# EAGLE schematic motor_schematic (EAGLE 8.4.1)
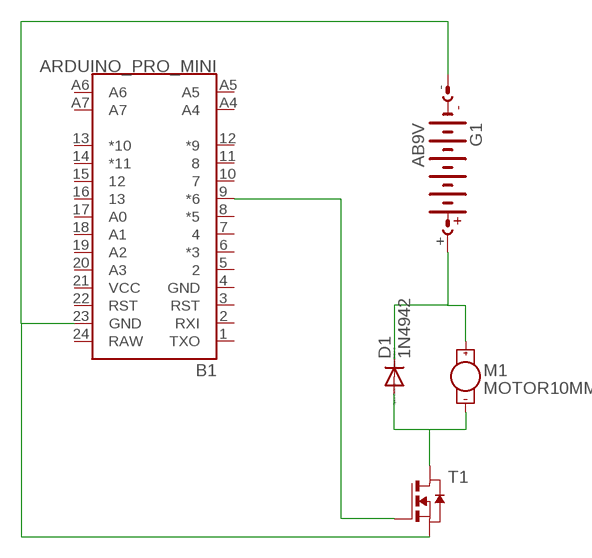
[diagram p0: schematic, sheet 1]

## Parts
B1  ARDUINO_PRO_MINI  [ARDUINO_PRO_MINI]
D1  1N4942  [DO41-10]
G1  AB9V  [AB9V]
M1  MOTOR10MM  [VIBE-MOTOR-10MM]
T1  NMOSSOT23  [SOT-23]

## Nets
N$1: D1.C G1.+ M1.+
N$2: D1.A M1.- T1.1(D)
N$3: B1.9(*6) T1.3(G)
N$4: B1.23(GND) G1.- T1.2(S)
Unconnected: B1.1(TXO) B1.2(RXI) B1.3(RST) B1.5 B1.6(*3) B1.7 B1.8(*5) B1.10 B1.11 B1.12(*9) B1.13(*10) B1.14(*11) B1.15 B1.16 B1.17(A0) B1.18(A1) B1.19(A2) B1.20(A3) B1.22(RST) B1.A4 B1.A5 B1.A6 B1.A7

## Power pins joined to a net without a drawn wire
GND: B1.4(GND)
RAW: B1.24(RAW)
VCC: B1.21(VCC)

## Library data of the parts
B1 = SparkFun-Boards:ARDUINO_PRO_MINI: SparkFun Pro Mini Pro Mini compatible footprint. Dimensions: 0.7 x 1.3" PCB Thickness: 0.8mm SparkFun Products: 3.3V/8MHz <https://www.sparkfun.com/products/11114> 5V/16MHz <https://www.sparkfun.com/products/11113>
D1 = diode:1N4942: DIODE 1.0 A, 200 V, 150 ns
G1 = battery:AB9V: 9-V BATTERY CLIP
M1 = SparkFun-Electromechanical:MOTOR: Motor (Single-Phase) Two-terminal, single-phase motors. SparkFun Products Vibration Motor <https://www.sparkfun.com/products/8449> (ROB-08449) Physical dimension and wire connections for this powerful vibration motor. Motor has a self adhesive backing.; PROD_ID: COMP-08572; SF_SKU: ROB-08449
T1 = zetex:NMOSSOT23: MOS FET; OC_FARNELL: unknown; OC_NEWARK: unknown